# Altium schematic sheet KY-012-Active-buzzer-module_2025-10-18.schdoc
size 61 x 58 mm
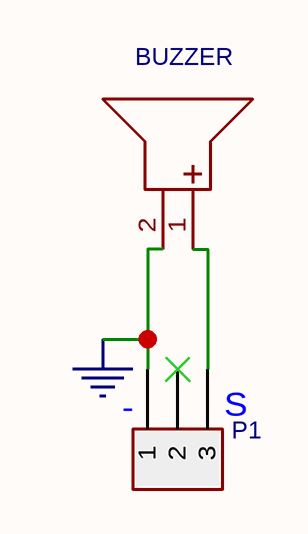
[diagram p0: KY-012-Active-buzzer-module_2025-10-18.schdoc]

## Parts
BUZZER  ZL-DCY09605-2705P-5  [BUZZER-R9.6-2P-5.0PITCH]  (value not drawn)
P1  Header-Male-2.54_1x3  [HDR-3X1/2.54]  (value not drawn)

## Nets
GND: BUZZER.2(-) P1.1
NetBUZZER_1: BUZZER.1(+) P1.3

Not connected (* = marked no-connect by the designer): P1 2*

## Notes on the sheet
- (near P1) -
- (near P1) S

## Library data of the parts
BUZZER = ZL-DCY09605-2705P-5: Manufacturer: ZLFY; Contributor: LCSC; Supplier: LCSC; Supplier Part: C194534; Manufacturer Part: ZL-DCY09605-2705P-5; spicePre: B
P1 = Header-Male-2.54_1x3: Manufacturer: LCSC; Supplier: LCSC; Manufacturer Part: Header-Male-2.54_1x3; spicePre: P; Supplier Part: C49257